# EAGLE design 2 stepper board (EAGLE 9.6.2)
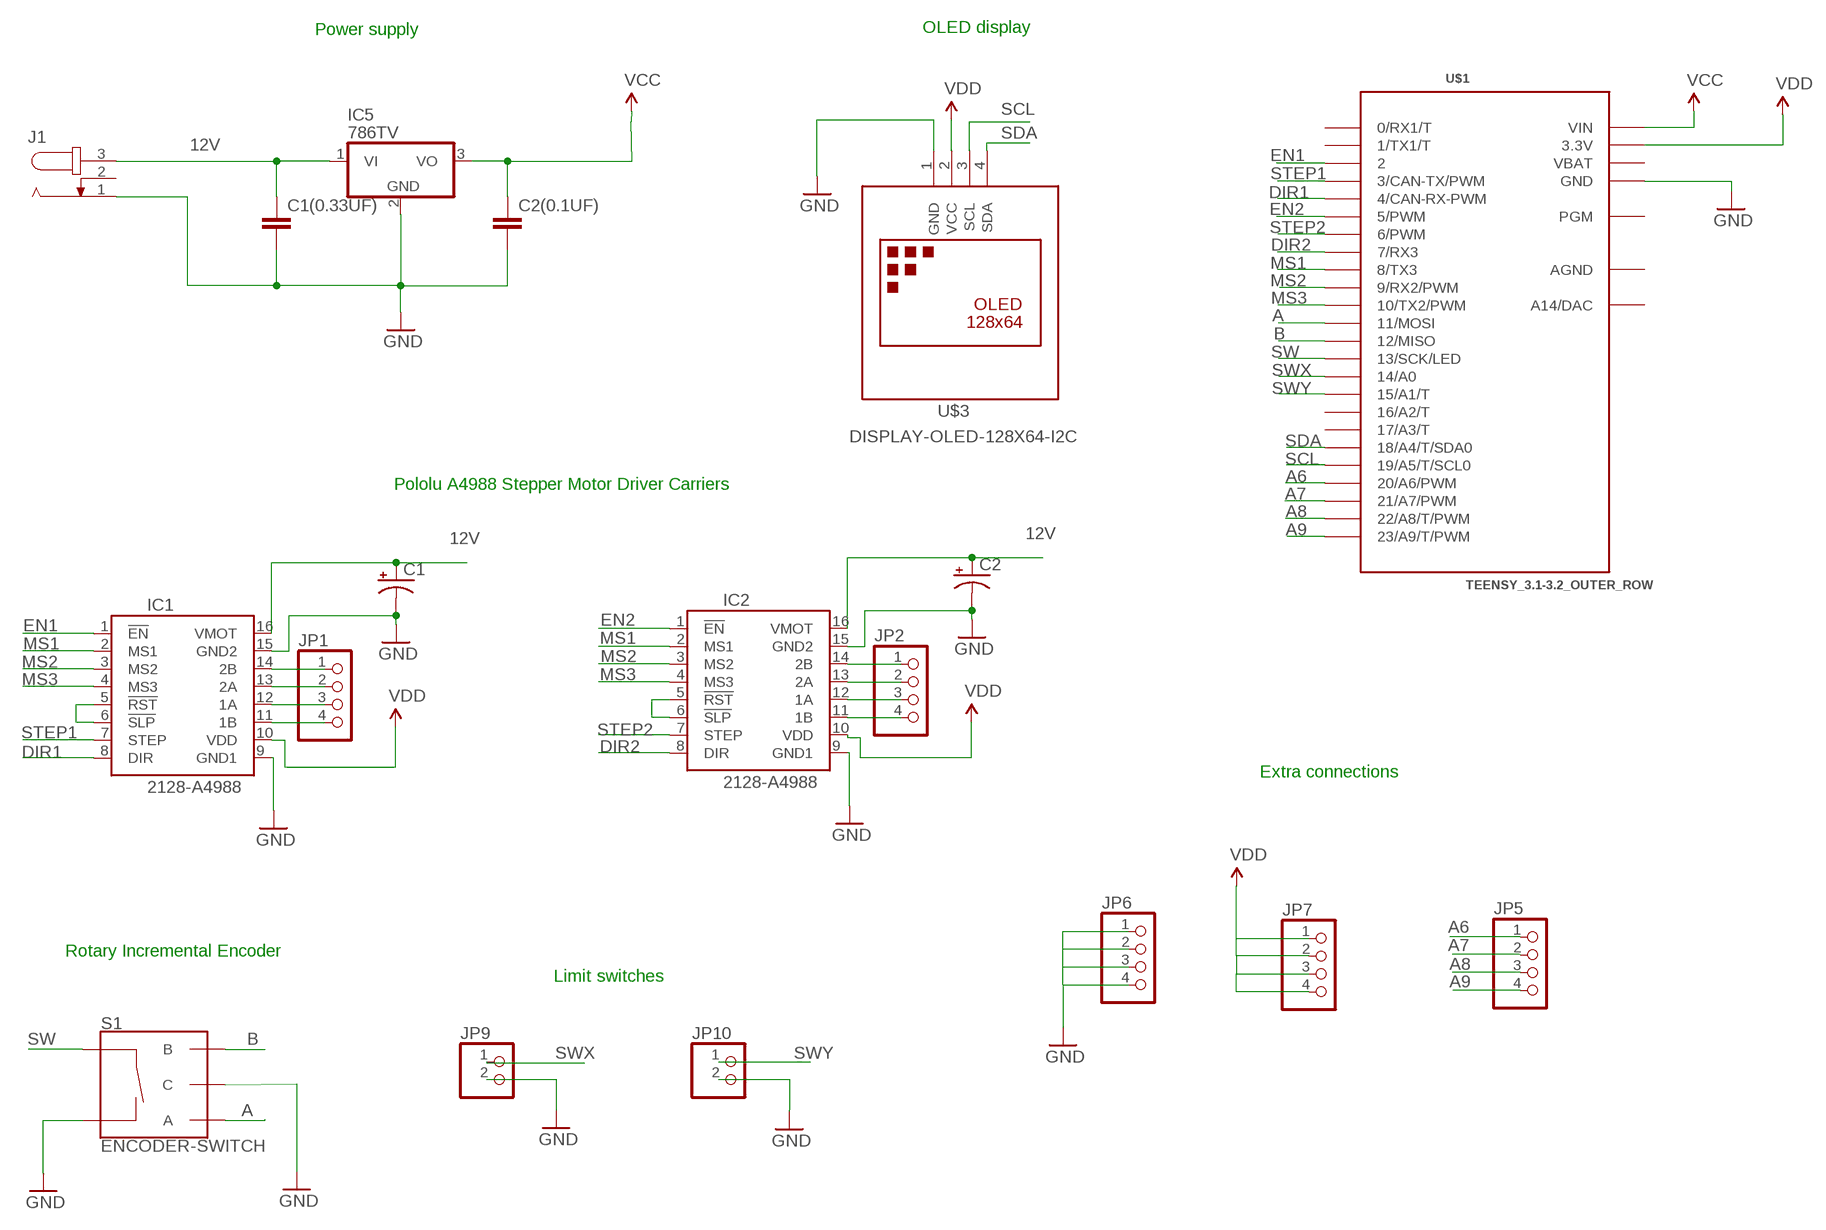
[diagram p0: schematic, sheet 1]

## Parts
C1  CPOL-USE5-5  [E5-5]
C1(0.33UF)  C2.5/4  [C2.5-4]
C2  CPOL-USE5-5  [E5-5]
C2(0.1UF)  C2.5/2  [C2.5-2]
IC1  2128-A4988  [A4988]
IC2  2128-A4988  [A4988]
IC5  786TV  [TO220V]
J1  JACK-PLUG0  [SPC4077]
JP1  PINHD-1X4  [1X04]
JP2  PINHD-1X4  [1X04]
JP5  PINHD-1X4  [1X04]
JP6  PINHD-1X4  [1X04]
JP7  PINHD-1X4  [1X04]
JP9  PINHD-1X2  [1X02]
JP10  PINHD-1X2  [1X02]
S1  ENCODER-SWITCH  [ROTARY_ENC_PLAIN]
U$1  TEENSY_3.1-3.2_OUTER_ROW  [TEENSY_3.0-3.2&LC_OUTER_ROW]
U$3  DISPLAY-OLED-128X64-I2C  [DISPLAY-OLED-128X64-I2C]

## Nets
12V: C1(0.33UF).1 C1.+ C2.+ IC1.16(VMOT) IC2.16(VMOT) IC5.1(VI) J1.3
A: S1.A U$1.11(11/MOSI)
A6: JP5.1 U$1.20/A6(20/A6/PWM)
A7: JP5.2 U$1.21/A7(21/A7/PWM)
A8: JP5.3 U$1.22/A8(22/A8/T/PWM)
A9: JP5.4 U$1.23/A9(23/A9/T/PWM)
B: S1.B U$1.12(12/MISO)
DIR1: IC1.8(DIR) U$1.4(4/CAN-RX-PWM)
DIR2: IC2.8(DIR) U$1.7(7/RX3)
EN1: IC1.1(!EN) U$1.2
EN2: IC2.1(!EN) U$1.5(5/PWM)
GND: C1(0.33UF).2 C1.- C2(0.1UF).2 C2.- IC1.9(GND1) IC1.15(GND2) IC2.9(GND1) IC2.15(GND2) IC5.2(GND) J1.1 JP6.1 JP6.2 JP6.3 JP6.4 JP9.2 JP10.2 S1.C S1.SW- U$1.GND U$1.GND1(GND) U$3.1(GND)
MS1: IC1.2(MS1) IC2.2(MS1) U$1.8(8/TX3)
MS2: IC1.3(MS2) IC2.3(MS2) U$1.9(9/RX2/PWM)
MS3: IC1.4(MS3) IC2.4(MS3) U$1.10(10/TX2/PWM)
N$1: IC1.14(2B) JP1.1
N$2: IC1.13(2A) JP1.2
N$3: IC1.12(1A) JP1.3
N$4: IC1.11(1B) JP1.4
N$5: IC2.14(2B) JP2.1
N$6: IC2.13(2A) JP2.2
N$7: IC2.12(1A) JP2.3
N$8: IC2.11(1B) JP2.4
N$15: IC2.5(!RST) IC2.6(!SLP)
N$23: IC1.5(!RST) IC1.6(!SLP)
SCL: U$1.19/A5(19/A5/T/SCL0) U$3.3(SCL)
SDA: U$1.18/A4(18/A4/T/SDA0) U$3.4(SDA)
STEP1: IC1.7(STEP) U$1.3(3/CAN-TX/PWM)
STEP2: IC2.7(STEP) U$1.6(6/PWM)
SW: S1.SW+ U$1.13(13/SCK/LED)
SWX: JP9.1 U$1.14/A0
SWY: JP10.1 U$1.15/A1(15/A1/T)
VCC: C2(0.1UF).1 IC5.3(VO) U$1.VIN
VDD: IC1.10(VDD) IC2.10(VDD) JP7.1 JP7.2 JP7.3 JP7.4 U$1.3.3V U$1.3.3V1(3.3V) U$3.2(VCC)
Unconnected: J1.2 U$1.0(0/RX1/T) U$1.1(1/TX1/T) U$1.16/A2(16/A2/T) U$1.17/A3(17/A3/T) U$1.PGM U$1.RESET/DAC(A14/DAC)

## Notes on the sheet
- Power supply | OLED display
- Pololu A4988 Stepper Motor Driver Carriers
- Extra connections
- Rotary Incremental Encoder
- Limit switches

## Power pins joined to a net without a drawn wire
AGND: U$1.AGND
VBAT: U$1.VBAT

## Library data of the parts
C1 C2 = adafruit:CPOL-US: POLARIZED CAPACITOR, American symbol
C1(0.33UF) C2(0.1UF) = capacitor-wima:C: CAPACITOR naming: grid - package width
IC1 IC2 = pololu-stepper-driver:2128-A4988: A4988 Stepper Motor Driver Carrier; Black Edition #2128 A4988 Stepper Motor Driver Carrier; Black Edition <https://www.pololu.com/product/2128> in Japan, Suzaku Lab. Ltd. <https://suzakugiken.jp/> #2128 A4988ステッピングモータドライバ Black Edition <https://szc.jp/po2128>
IC5 = linear:78*: Positive VOLTAGE REGULATOR Source: http://cache.national.com/ds/LM/LM78L05.pdf http://www.fairchildsemi.com/ds/LM/LM7805.pdf
J1 = con-jack:JACK-PLUG: DC POWER JACK Power Jack, DC, Right Angle, Through Hole, Rated 5A at 16VDC, PC Terminals Distributor: Farnell (www.Farnell.de) Drawing: 84N1161.pdf / 84N1162.pdf Manufacturer: SPC Technology (www.spctechnology.com) Type: SPC4077 / SPC 4078; OC_FARNELL: unknown; OC_NEWARK: unknown
JP1 JP2 JP5-JP7 = pinhead:PINHD-1X4: PIN HEADER
JP9 JP10 = pinhead:PINHD-1X2: PIN HEADER
S1 = SparkFun-Switches:ENCODER-SWITCH: Rotary Encoder w/ Select Switch Encoders rotate similarly to potentiometers, but they’re different from potentiometers in that an encoder has full rotation without limits. They output gray code so that you can tell how much and in which direction the encoder has been turned. This encoder includes a push-down select switch built into the shaft. SparkFun Products Rotary Encoder <https://www.sparkfun.com/products/9117> (COM-09117); SF_SKU: COM-09117
U$1 = Teensy_3_and_LC_Series_Boards_v1.4:TEENSY_3.1-3.2_OUTER_ROW: Footprint for Teensy 3.1 or 3.2 board using all pin connections on the outer perimeter
U$3 = diy-modules:DISPLAY-OLED-128X64-I2C: 128x64 Dot Matrix OLED Module based on SSD1306 chip Variant with I2C interface More details available here: http://www.instructables.com/id/Monochrome-096-i2c-OLED-display-with-arduino-SSD13/ SSD1306 datasheet: https://cdn-shop.adafruit.com/datasheets/SSD1306.pdf Click here to find device on ebay.com <http://www.ebay.com/sch/oled+display+128x64+iic> Note: There are two variants: I2C and SPI. Search for the proper version.

## Net classes
0 default: width 0.203 mm, drill 0.406 mm, clearance 0.203 mm

## Board
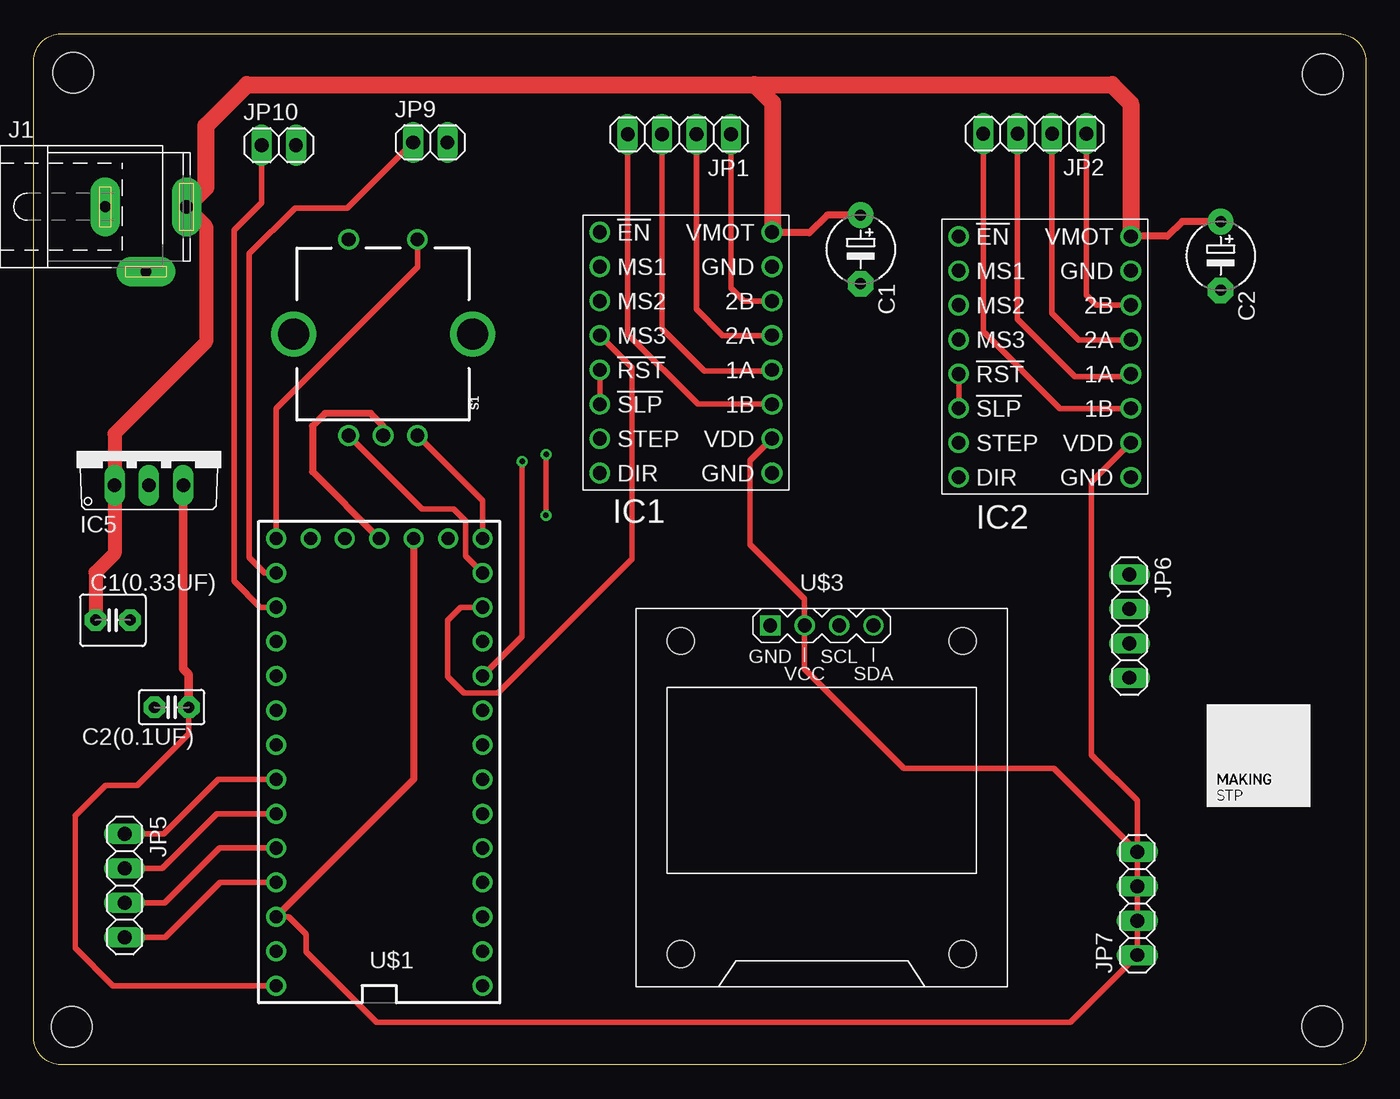
[diagram p1: board, top side]
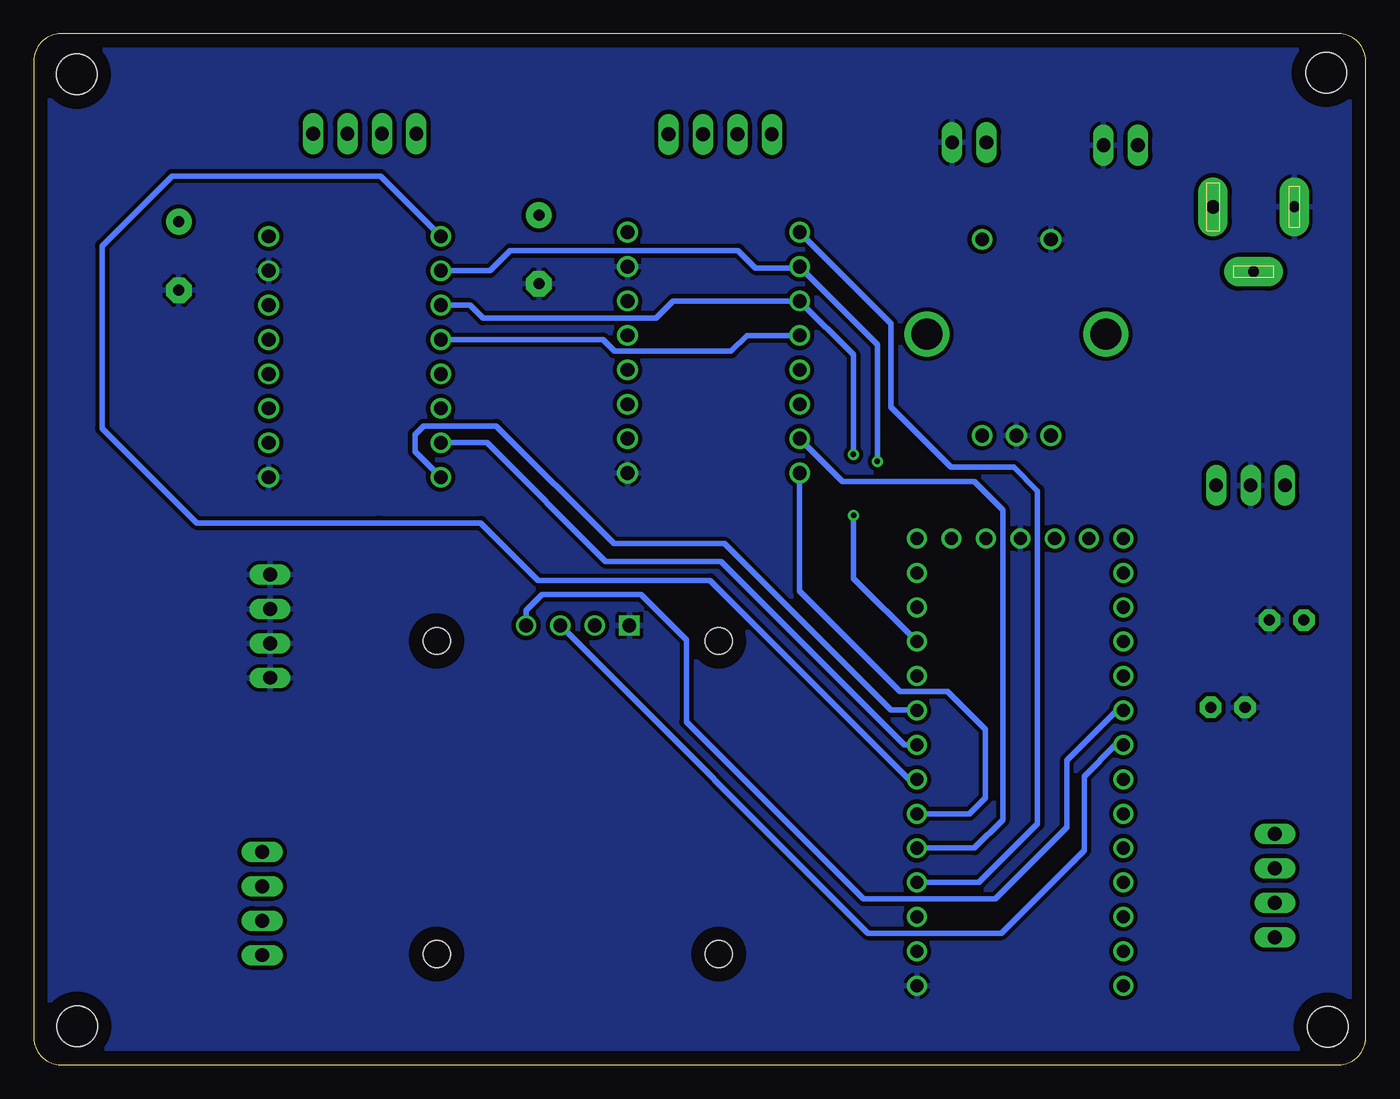
[diagram p2: board, bottom side, seen from below]

Size 98.3 x 76.1 mm. Coordinates in mm from the lower left corner, seen from the top.
Outline: 96.3,0 2,0 arc-90 0,2 0,74.1 arc-90 2,76.1 96.3,76.1 arc-90 98.3,74.1 98.3,2 arc-90 96.3,0
Copper layers (1*16): Top 0.035mm / dielectric 1.5mm / Bottom 0.035mm
Design rules "default": minimum track width 6mil, minimum drill 0.35mm, track to track 6mil, track to pad 6mil, pad to pad 6mil, via to via 6mil, smd to smd 6mil, copper to edge 40mil, drill to drill 6mil, minimum pad ring 10mil, minimum via ring 8mil, stop-mask expansion 4mil, vias tented up to drill 0mil, thermal gap 10mil
Holes 3 mm at 95.13,73.11 95.12,2.86 2.8,2.8 2.92,73.23

### Footprints (pad centres in the part's own frame; a part is rotated, then mirrored left to right if it is on the bottom)
E5-5 = drill 0.813 pad 1.905: + -2.54,0 | drill 0.813 pad 1.905 octagon: - 2.54,0
C2.5-4 = drill 0.813 pad 1.6 octagon: 1 -1.27,0; 2 1.27,0
C2.5-2 = drill 0.813 pad 1.6 octagon: 1 -1.27,0; 2 1.27,0
A4988 = drill 1.016: 1 -6.35,8.89; 2 -6.35,6.35; 3 -6.35,3.81; 4 -6.35,1.27; 5 -6.35,-1.27; 6 -6.35,-3.81; 7 -6.35,-6.35; 8 -6.35,-8.89; 9 6.35,-8.89; 10 6.35,-6.35; 11 6.35,-3.81; 12 6.35,-1.27; 13 6.35,1.27; 14 6.35,3.81; 15 6.35,6.35; 16 6.35,8.89
TO220V = drill 1.016 long: 1 -2.54,-2.54; 2 0,-2.54; 3 2.54,-2.54
SPC4077 = drill 0.8 pad 2.184 long: 1 -3,0; 2 0,-4.8 | drill 1 pad 2.184 long: 3 3,0
1X04 = drill 1.016 long: 1 -3.81,0; 2 -1.27,0; 3 1.27,0; 4 3.81,0
1X02 = drill 1.016 long: 1 -1.27,0; 2 1.27,0
ROTARY_ENC_PLAIN = drill 1.016: A 7.493,-2.54; B 7.493,2.54; C 7.493,0; SW+ -6.985,2.54; SW- -6.985,-2.54 | drill 2.286: P$3 0,6.604; P$4 0,-6.604
TEENSY_3.0-3.2&LC_OUTER_ROW = drill 0.965: 0 -7.62,13.97; 1 -7.62,11.43; 2 -7.62,8.89; 3 -7.62,6.35; 3.3V 7.62,11.43; 3.3V1 -2.54,-16.51; 4 -7.62,3.81; 5 -7.62,1.27; 6 -7.62,-1.27; 7 -7.62,-3.81; 8 -7.62,-6.35; 9 -7.62,-8.89; 10 -7.62,-11.43; 11 -7.62,-13.97; 12 -7.62,-16.51; 13 7.62,-16.51; 14/A0 7.62,-13.97; 15/A1 7.62,-11.43; 16/A2 7.62,-8.89; 17/A3 7.62,-6.35; 18/A4 7.62,-3.81; 19/A5 7.62,-1.27; 20/A6 7.62,1.27; 21/A7 7.62,3.81; 22/A8 7.62,6.35; 23/A9 7.62,8.89; AGND 7.62,13.97; GND -7.62,16.51; GND1 0,-16.51; PGM 2.54,-16.51; RESET/DAC 5.08,-16.51; VBAT -5.08,-16.51; VIN 7.62,16.51
DISPLAY-OLED-128X64-I2C = drill 1 square: 1 -3.81,12.7 | drill 1: 2 -1.27,12.7; 3 1.27,12.7; 4 3.81,12.7 | hole 2: -10.414,11.557; 10.414,11.557; 10.414,-11.557; -10.414,-11.557

### Placement (x,y rotation side)
C1  61.03,60.19 270 top
C1(0.33UF)  5.83,32.82 0 top
C2  87.6,59.71 270 top
C2(0.1UF)  10.17,26.39 180 top
IC1  48.13,52.57 0 top
IC2  74.62,52.26 0 top
IC5  8.49,45.32 0 top
J1  8.27,63.34 0 top
JP1  47.64,68.69 180 top
JP2  73.88,68.73 180 top
JP5  6.7,13.22 270 top
JP6  80.87,32.38 270 top
JP7  81.45,11.9 90 top
JP9  29.25,68.09 0 top
JP10  18.08,67.89 0 top
S1  25.77,53.94 270 top
U$1  25.49,22.34 180 top
U$3  58.16,19.73 0 top

### Tracks (layer width: path | path; a pad name or v marks a point on that pad's centre or on a via)
12V
  Top 0.508: C1.+ 58.57,62.73 57.24,61.41 54.53,61.41 IC1.16 | C2.+ 84.75,62.25 83.66,61.15 IC2.16
  Top 1.016: J1.3 12.72,61.89 12.72,53.36 5.95,46.59 IC5.1 5.95,37.75 4.56,36.36 C1(0.33UF).1
  Top 1.27: J1.3 12.72,64.78 12.72,69.33 15.74,72.36 53.18,72.36 | 53.18,72.36 54.53,71.01 54.53,61.41 | 53.18,72.36 79.57,72.36 80.97,70.96 IC2.16
A
  Top 0.406: S1.A 28.67,41.01 30.98,41.01 31.87,40.12 31.87,37.56 U$1.11
A6
  Top 0.406: JP5.1 9.57,17.03 13.61,21.07 U$1.20/A6
A7
  Top 0.406: JP5.2 9.47,14.49 13.5,18.53 U$1.21/A7
A8
  Top 0.406: JP5.3 9.67,11.95 13.71,15.99 U$1.22/A8
A9
  Top 0.406: JP5.4 9.7,9.41 13.73,13.45 U$1.23/A9
B
  Top 0.406: S1.B 33.11,41.65 U$1.12
DIR1
  Bottom 0.406: IC1.8 41.78,34.97 34.36,27.55 30.85,27.55 28.06,24.76 28.06,19.7 29.23,18.53 U$1.4
DIR2
  Bottom 0.406: IC2.8 70.17,45.28 70.17,46.52 69.54,47.16 64.18,47.16 55.49,38.47 47.34,38.47 35.04,26.18 33.14,26.18 U$1.7
EN1
  Bottom 0.406: IC1.1 35.05,54.73 35.05,48.56 30.6,44.11 25.98,44.11 24.22,42.36 24.22,17.77 28.54,13.45 U$1.2
EN2
  Bottom 0.406: IC2.1 72.71,65.6 88.11,65.6 93.26,60.44 93.26,46.98 88.21,41.93 88.05,41.77 86.28,40 72.92,40 72.69,40 65.32,40 61.08,35.75 48.41,35.75 33.72,21.07 U$1.5
GND
  Top 0.508: S1.C 25.77,47.16 24.86,48.07 21.48,48.07 20.57,47.16 20.57,43.78 U$1.GND1
  pour Bottom (isolate 0.305): 98.54,-0.4 -0.3,-0.4 -0.3,76.35 96.54,76.35 arc-90 98.54,74.35
MS1  (via drill 0.41)
  Top 0.406: v36.04,44.54 36.04,31.61 U$1.8
  Bottom 0.406: IC2.2 64.64,58.61 63.14,60.11 46.32,60.11 45.03,58.82 41.88,58.82 IC1.2 36.04,53.18 v36.04,44.54
MS2  (via drill 0.41)
  Top 0.406: v37.81,45.05 37.81,40.58 v37.79,40.55
  Bottom 0.406: IC2.3 66.11,56.07 65.14,55.11 52.39,55.11 51.12,56.38 IC1.3 37.81,52.42 v37.81,45.05 | v37.79,40.55 37.79,35.91 U$1.9
MS3
  Top 0.406: IC1.4 44.14,51.48 44.14,37.33 34.26,27.45 31.77,27.45 30.55,28.67 30.55,32.81 31.51,33.77 U$1.10
  Bottom 0.406: IC2.4 56.3,53.53 55.44,52.67 46.83,52.67 45.66,53.84 IC1.4
N$1
  Top 0.406: JP1.1 51.45,57.34 52.42,56.38 IC1.14
N$2
  Top 0.406: JP1.2 48.91,55.77 50.84,53.84 IC1.13
N$3
  Top 0.406: JP1.3 46.37,54.35 49.5,51.22 54.4,51.22 IC1.12
N$4
  Top 0.406: IC1.11 49.02,48.76 43.83,53.94 JP1.4
N$5
  Top 0.406: JP2.1 77.69,56.81 78.43,56.07 IC2.14
N$6
  Top 0.406: JP2.2 75.15,55.49 77.13,53.51 80.94,53.51 IC2.13
N$7
  Top 0.406: JP2.3 72.61,55.06 76.85,50.82 80.79,50.82 IC2.12
N$8
  Top 0.406: IC2.11 75.73,48.45 70.07,54.12 JP2.4
N$15
  Top 0.406: IC2.5 IC2.6
N$23
  Top 0.406: IC1.5 IC1.6
SCL
  Bottom 0.406: U$3.3 36.72,9.72 26.89,9.72 20.77,15.84 20.77,21.3 18.46,23.61 U$1.19/A5
SDA
  Bottom 0.406: U$3.4 61.97,33.54 60.8,34.71 53.48,34.71 50.13,31.36 50.13,25.32 37.05,12.23 27.32,12.23 22.04,17.52 22.04,22.47 18.36,26.15 U$1.18/A4
STEP1
  Bottom 0.406: IC1.7 38.6,43.04 28.87,43.04 26.79,40.96 26.79,18.08 28.87,15.99 U$1.3
STEP2
  Bottom 0.406: IC2.7 64.86,45.91 56.1,37.15 47.57,37.15 34.03,23.61 U$1.6
SW
  Top 0.406: S1.SW+ 28.31,58.87 17.87,48.43 U$1.13
SWX
  Top 0.406: JP9.1 23.13,63.24 19.27,63.24 15.89,59.86 15.89,37.46 17.04,36.31 U$1.14/A0
SWY
  Top 0.406: JP10.1 16.81,63.64 14.77,61.61 14.77,35.7 16.71,33.77 U$1.15/A1
VCC
  Top 0.406: C2(0.1UF).1 11.44,24.42 7.64,20.62 5.3,20.62 3.04,18.36 3.04,8.63 5.83,5.83 U$1.VIN
  Top 0.61: IC5.3 11.03,29.21 11.44,28.8 C2(0.1UF).1
VDD
  Top 0.406: JP7.4 JP7.3 JP7.2 JP7.1 76.5,3.14 25.29,3.14 20.11,8.32 20.11,9.62 18.81,10.91 U$1.3.3V | JP7.4 75.28,21.89 64.23,21.89 56.89,29.23 U$3.2 56.89,34.38 52.85,38.42 52.85,44.59 IC1.10 | IC2.10 78.07,43.02 78.07,22.88 81.45,19.5 JP7.4
  Top 0.508: U$1.3.3V1 28.03,21.07 U$1.3.3V